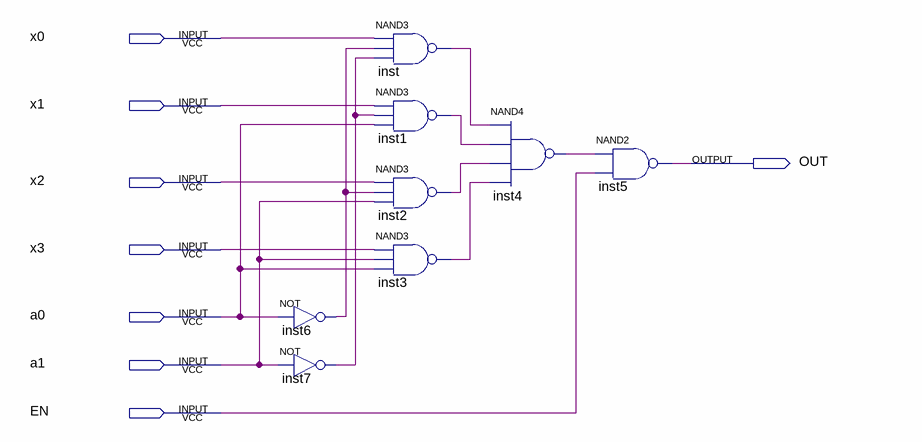
[diagram p0: schematic sheet]
// Quartus schematic mux_4in_1out.bdf as structural Verilog: 8 symbols, 8 pins
module mux_4in_1out (
  input  x0,
  input  x1,
  input  x2,
  input  x3,
  input  a0,
  input  a1,
  input  EN,
  output OUT
);

  wire inst1_out, inst2_out, inst3_out, inst4_out, inst6_out, inst7_out, inst_out;

  not inst6 (inst6_out, a0);
  not inst7 (inst7_out, a1);
  nand inst (inst_out, x0, inst6_out, inst7_out);
  nand inst1 (inst1_out, x1, inst7_out, a0);
  nand inst2 (inst2_out, x2, inst6_out, a1);
  nand inst3 (inst3_out, x3, a1, a0);
  nand inst4 (inst4_out, inst_out, inst1_out, inst2_out, inst3_out);
  nand inst5 (OUT, inst4_out, EN);
endmodule
